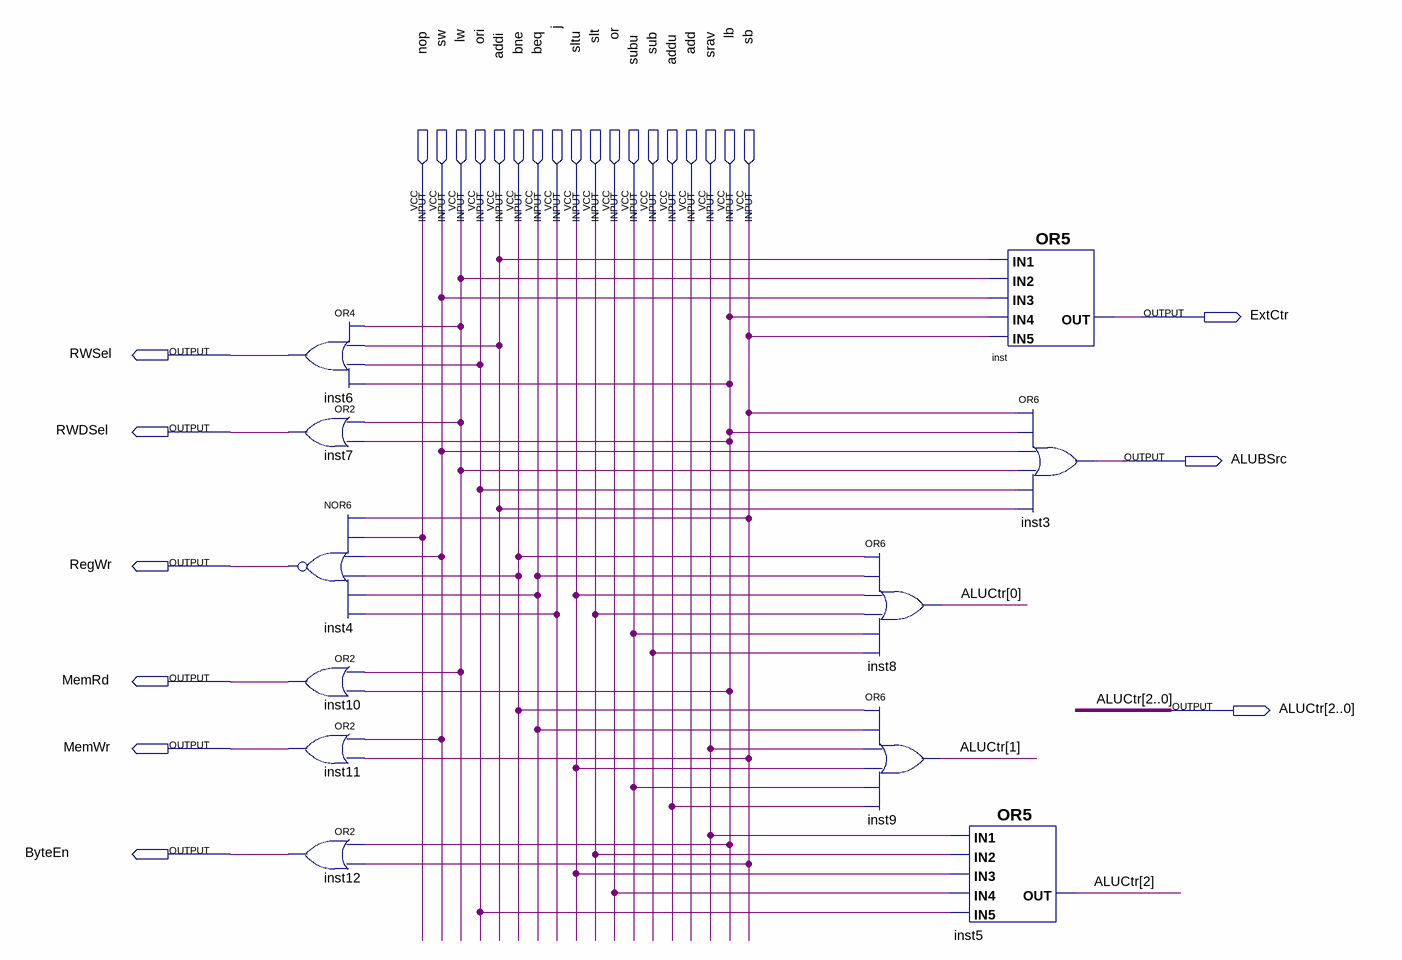
[diagram p0: schematic sheet]
// Quartus schematic uOPGen.bdf as structural Verilog: 11 symbols, 27 pins
module uOPGen (
  input  nop,
  input  sw,
  input  lw,
  input  ori,
  input  addi,
  input  bne,
  input  beq,
  input  j,
  input  sltu,
  input  slt,
  input  \or ,
  input  subu,
  input  sub,
  input  addu,
  input  add,
  input  srav,
  input  lb,
  input  sb,
  output ExtCtr,
  output RWSel,
  output RWDSel,
  output ALUBSrc,
  output RegWr,
  output MemRd,
  output [2:0] ALUCtr,
  output MemWr,
  output ByteEn
);

  or inst6 (RWSel, lw, addi, ori, lb);
  or inst7 (RWDSel, lw, lb);
  nor inst4 (RegWr, sb, nop, sw, bne, beq, j);
  or inst10 (MemRd, lw, lb);
  or inst11 (MemWr, sw, sb);
  or inst12 (ByteEn, lb, sb);
  or inst8 (ALUCtr[0], bne, beq, sltu, slt, subu, sub);
  or inst9 (ALUCtr[1], bne, beq, srav, sltu, subu, addu);
  or inst5 (ALUCtr[2], srav, slt, sltu, \or , ori);
  or inst (ExtCtr, addi, lw, sw, lb, sb);
  or inst3 (ALUBSrc, sb, lb, sw, lw, ori, addi);
endmodule
